# EAGLE design hpdNode (EAGLE 6.6.0)
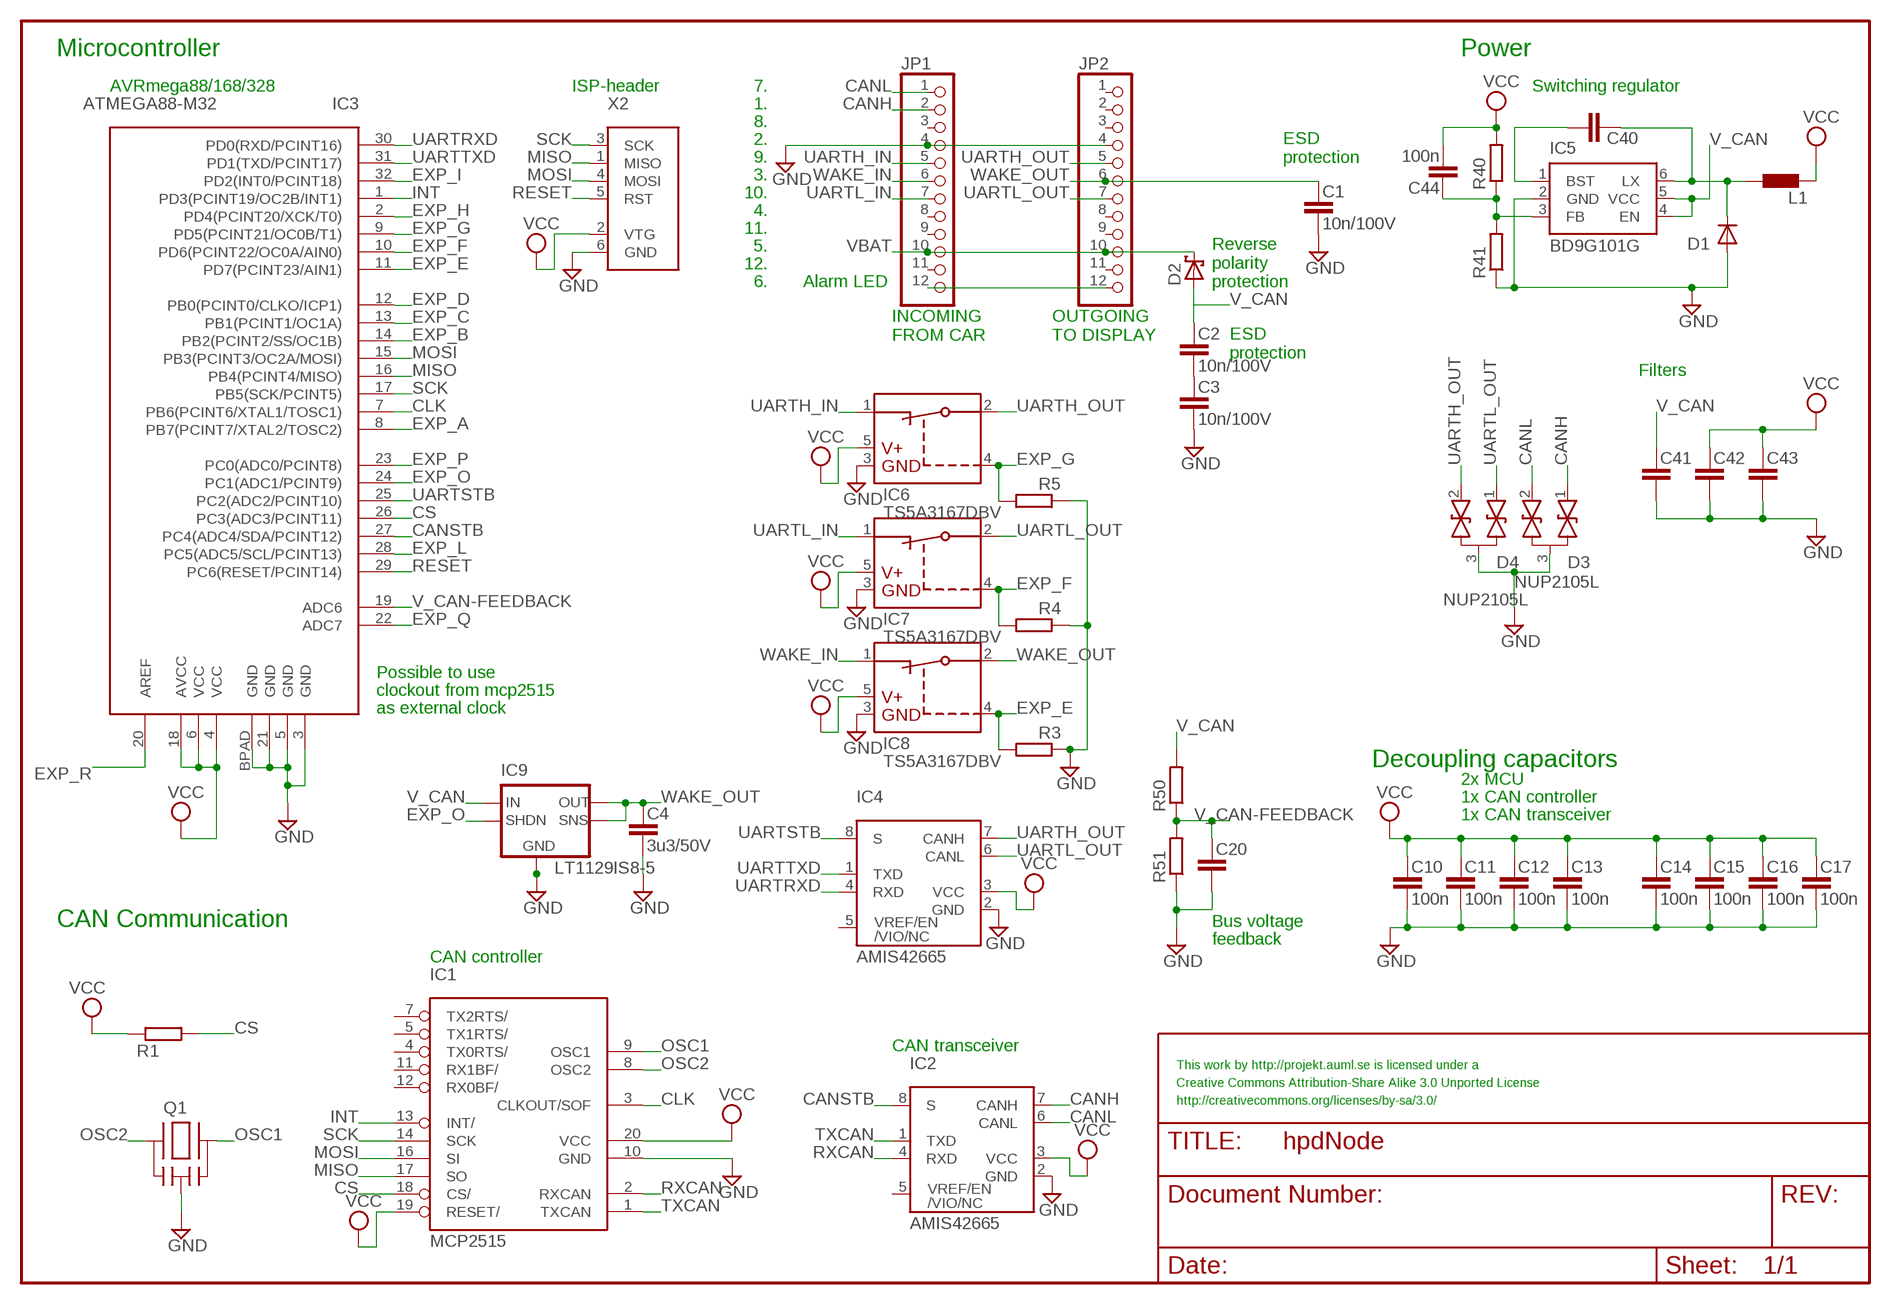
[diagram p0: schematic, sheet 1]

## Parts
C1  10n/100V  C-EUC0805  [C0805]
C2  10n/100V  C-EUC0805  [C0805]
C3  10n/100V  C-EUC0805  [C0805]
C4  3u3/50V  C-EUC1210  [C1210]
C10  100n  C-EUC0402  [C0402]
C11  100n  C-EUC0402  [C0402]
C12  100n  C-EUC0402  [C0402]
C13  100n  C-EUC0402  [C0402]
C14  100n  C-EUC0402  [C0402]
C15  100n  C-EUC0402  [C0402]
C16  100n  C-EUC0402  [C0402]
C17  100n  C-EUC0402  [C0402]
C20  C-EUC0402  [C0402]
C40  C-EUC0603  [C0603]
C41  C-EUC1210  [C1210]
C42  C-EUC0805  [C0805]
C43  C-EUC0402  [C0402]
C44  100n  C-EUC0402  [C0402]
D1  DIODESMP  [DO-220AA]
D2  SCHOTTKY-DIODESMA  [SMA]
D3  NUP2105L  DUALTVSSOT23  [SOT23]
D4  NUP2105L  DUALTVSSOT23  [SOT23]
IC1  MCP2515  [TSSOP]
IC2  AMIS42665  [SOIC]
IC3  ATMEGA88-M32  [MLF32]
IC4  AMIS42665  [SOIC]
IC5  BD9G101G  [SSOP6]
IC6  TS5A3167DBV  [SOT23-5]
IC7  TS5A3167DBV  [SOT23-5]
IC8  TS5A3167DBV  [SOT23-5]
IC9  LT1129IS8-5  LT1129-5SO8  [SO8]
JP1  PINHD-2X06  [2X06]
JP2  PINHD-2X06  [2X06]
L1  L-EUL1210  [L1210]
Q1  CSTCESMD  [SMD]
R1  R-EUR0402  [R0402]
R3  R-EUR0402  [R0402]
R4  R-EUR0402  [R0402]
R5  R-EUR0402  [R0402]
R40  R-EUR0402  [R0402]
R41  R-EUR0402  [R0402]
R50  R-EUR0402  [R0402]
R51  R-EUR0402  [R0402]
X2  AVRISP6PINHEADER  [6PINHEADER]

## Nets
CANH: D3.1 IC2.7(CANH) JP1.2
CANL: D3.2 IC2.6(CANL) JP1.1
CANSTB: IC2.8(S) IC3.27(PC4(ADC4/SDA/PCINT12))
CB: C40.1 IC5.1(BST)
CLK: IC1.3(CLKOUT/SOF) IC3.7(PB6(PCINT6/XTAL1/TOSC1))
CS: IC1.18(CS/) IC3.26(PC3(ADC3/PCINT11)) R1.2
EXP_A: IC3.8(PB7(PCINT7/XTAL2/TOSC2))
EXP_B: IC3.14(PB2(PCINT2/SS/OC1B))
EXP_C: IC3.13(PB1(PCINT1/OC1A))
EXP_D: IC3.12(PB0(PCINT0/CLKO/ICP1))
EXP_E: IC3.11(PD7(PCINT23/AIN1)) IC8.4(IN) R3.2
EXP_F: IC3.10(PD6(PCINT22/OC0A/AIN0)) IC7.4(IN) R4.2
EXP_G: IC3.9(PD5(PCINT21/OC0B/T1)) IC6.4(IN) R5.2
EXP_H: IC3.2(PD4(PCINT20/XCK/T0))
EXP_I: IC3.32(PD2(INT0/PCINT18))
EXP_L: IC3.28(PC5(ADC5/SCL/PCINT13))
EXP_O: IC3.24(PC1(ADC1/PCINT9)) IC9.5(SHDN)
EXP_P: IC3.23(PC0(ADC0/PCINT8))
EXP_Q: IC3.22(ADC7)
EXP_R: IC3.20(AREF)
GND: C1.2 C3.2 C4.2 C10.2 C11.2 C12.2 C13.2 C14.2 C15.2 C16.2 C17.2 C20.2 C41.2 C42.2 C43.2 D1.A D3.3 D4.3 IC1.10(GND) IC2.2(GND) IC3.3(GND) IC3.5(GND) IC3.21(GND) IC3.BPAD(GND) IC4.2(GND) IC5.2(GND) IC6.3(GND) IC7.3(GND) IC8.3(GND) IC9.3(GND) IC9.6(GND1) IC9.7(GND2) JP1.4 JP2.4 Q1.2(GND) R3.1 R4.1 R5.1 R41.1 R51.1 X2.6(GND)
INT: IC1.13(INT/) IC3.1(PD3(PCINT19/OC2B/INT1))
MISO: IC1.17(SO) IC3.16(PB4(PCINT4/MISO)) X2.1(MISO)
MOSI: IC1.16(SI) IC3.15(PB3(PCINT3/OC2A/MOSI)) X2.4(MOSI)
N$1: C44.1 IC5.3(FB) R40.1 R41.2
N$2: C2.2 C3.1
N$13: JP1.12 JP2.12
OSC1: IC1.9(OSC1) Q1.3
OSC2: IC1.8(OSC2) Q1.1
RESET: IC3.29(PC6(RESET/PCINT14)) X2.5(RST)
RXCAN: IC1.2(RXCAN) IC2.4(RXD)
SCK: IC1.14(SCK) IC3.17(PB5(SCK/PCINT5)) X2.3(SCK)
TXCAN: IC1.1(TXCAN) IC2.1(TXD)
UARTH_IN: IC6.1(NC) JP1.5
UARTH_OUT: D4.2 IC4.7(CANH) IC6.2(COM) JP2.5
UARTL_IN: IC7.1(NC) JP1.7
UARTL_OUT: D4.1 IC4.6(CANL) IC7.2(COM) JP2.7
UARTRXD: IC3.30(PD0(RXD/PCINT16)) IC4.4(RXD)
UARTSTB: IC3.25(PC2(ADC2/PCINT10)) IC4.8(S)
UARTTXD: IC3.31(PD1(TXD/PCINT17)) IC4.1(TXD)
V_CAN: C2.1 C41.1 D2.A IC5.4(EN) IC5.5(VCC) IC9.8(IN) R50.2
V_CAN-FEEDBACK: C20.1 IC3.19(ADC6) R50.1 R51.2
VBAT: D2.C JP1.10 JP2.10
VCC: C10.1 C11.1 C12.1 C13.1 C14.1 C15.1 C16.1 C17.1 C42.1 C43.1 C44.2 IC1.19(RESET/) IC1.20(VCC) IC2.3(VCC) IC3.4(VCC) IC3.6(VCC) IC3.18(AVCC) IC4.3(VCC) IC6.5(VCC) IC7.5(VCC) IC8.5(VCC) L1.1 R1.1 R40.2 X2.2(VTG)
VSW: C40.2 D1.C IC5.6(LX) L1.2
WAKE_IN: IC8.1(NC) JP1.6
WAKE_OUT: C1.1 C4.1 IC8.2(COM) IC9.1(OUT) IC9.2(SENSE) JP2.6
Unconnected: IC1.4(TX0RTS/) IC1.5(TX1RTS/) IC1.7(TX2RTS/) IC1.11(RX1BF/) IC1.12(RX0BF/) IC2.5(VREF/EN/VIO/NC) IC4.5(VREF/EN/VIO/NC) JP1.3 JP1.8 JP1.9 JP1.11 JP2.1 JP2.2 JP2.3 JP2.8 JP2.9 JP2.11

## Notes on the sheet
- Microcontroller | Power
- AVRmega88/168/328 | ISP-header | 7. | Switching regulator
- 1.
- 8.
- 2.
- 9.
- ESD
  protection
- 3.
- 10.
- 4.
- 11.
- 5.
- 12.
- 6. | Alarm LED
- Reverse
  polarity
  protection
- INCOMING
  FROM CAR
- OUTGOING
  TO DISPLAY
- ESD
  protection
- Filters
- Possible to use
- clockout from mcp2515
- as external clock
- Decoupling capacitors
- 2x MCU
- 1x CAN controller
- 1x CAN transceiver
- CAN Communication | Bus voltage
- feedback
- CAN controller
- CAN transceiver
- This work by http://projekt.auml.se is licensed under a
- Creative Commons Attribution-Share Alike 3.0 Unported License
- http://creativecommons.org/licenses/by-sa/3.0/

## Library data of the parts
C1-C4 C10-C17 C20 C40-C44 = rcl:C-EU
D1 = diode:DIODE: DIODE ultra fast rectifier, 3 A
D2 = diode:SCHOTTKY-DIODE
D3 D4 = diode:DUALTVS
IC1 = mcp2515:MCP2515
IC2 IC4 = amis42665:AMIS42665
IC3 = atmega88:ATMEGA88-M32
IC5 = BD9G101G:BD9G101G
IC6-IC8 = ts5a3167:TS5A3167
IC9 = lt1129:LT1129-5
JP1 JP2 = pinhead-mm:PINHD-2X06
L1 = rcl:L-EU
Q1 = xtal_CSTCE:CSTCE
R1 R3-R5 R40 R41 R50 R51 = rcl:R-EU
X2 = avrisp:AVRISP6PIN

## Board
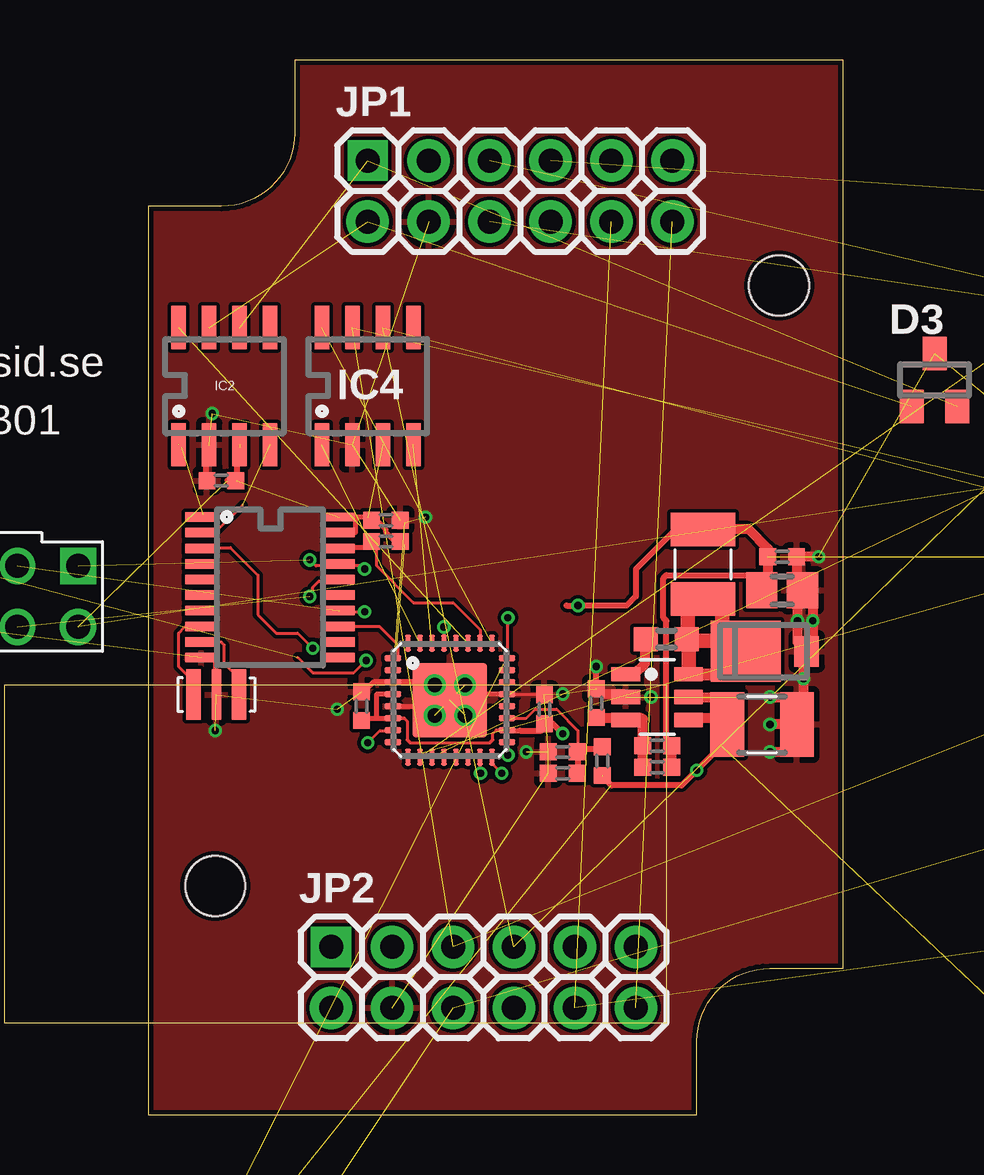
[diagram p1: board, top side]
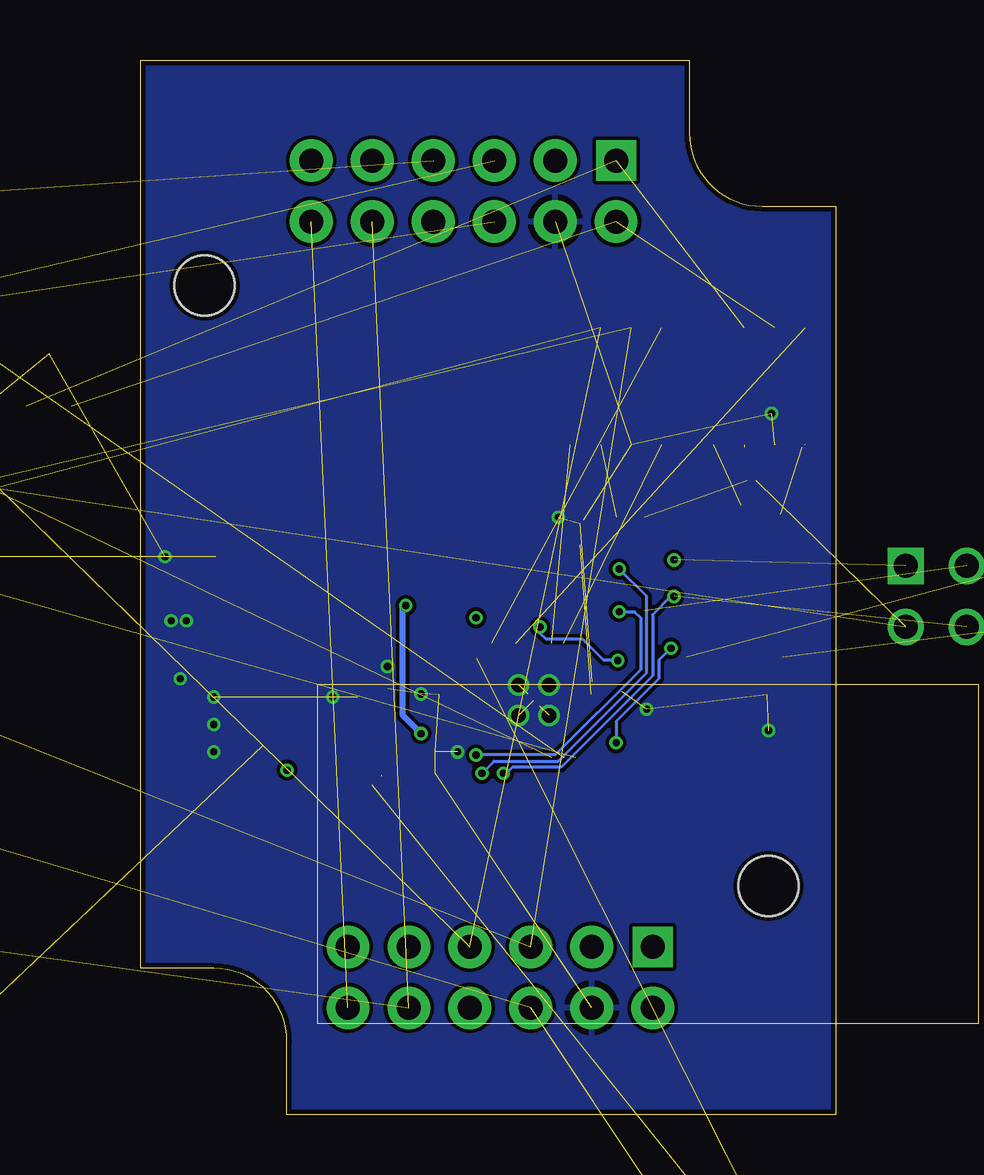
[diagram p2: board, bottom side, seen from below]

Size 28.96 x 43.94 mm. Coordinates in mm from the lower left corner, seen from the top.
Outline: 28.96,6.1 28.96,43.94 6.1,43.94 6.1,40.89 arc-90 3.05,37.85 0,37.85 0,0 22.86,0 22.86,3.05 arc-90 25.91,6.1 28.96,6.1
Copper layers (1*16): Top 0.035mm / dielectric 1.5mm / Bottom 0.035mm
Design rules "10mils, 0.6drill *": minimum track width 5mil, minimum drill 0.3mm, track to track 5mil, track to pad 5mil, pad to pad 6mil, via to via 6mil, smd to smd 0mil, copper to edge 8mil, drill to drill 10mil, minimum pad ring 10mil, minimum via ring 5mil, stop-mask expansion 0mil, vias tented up to drill 0.7mm, thermal gap 10mil
Holes 2.5 mm at 2.79,9.53 26.29,34.54
tKeepout: area 1,7.7 to 4.6,11.3; area 24.5,32.8 to 28.1,36.3
bKeepout: area 1,7.7 to 4.6,11.3; area 24.5,32.8 to 28.1,36.3
Milling: 4 lines

### Footprints (pad centres in the part's own frame; a part is rotated, then mirrored left to right if it is on the bottom)
C0805 = smd 1.3 x 1.5: 1 -0.85,0; 2 0.85,0
C1210 = smd 1.4 x 2.7: 1 -1.4,0; 2 1.5,0
C0402 = smd 0.7 x 0.7: 1 -0.6,0; 2 0.6,0
C0603 = smd 1 x 1: 1 -0.85,0; 2 0.85,0
DO-220AA = smd 1.016 x 1.27: A 1.143,0 | smd 2.921 x 2.54: C -1.397,0
SMA = smd 2.1 x 1.8: A 2.1,0; C -2.3,0
SOT23 = smd 1 x 1.4: 1 -0.95,-1.1; 2 0.95,-1.1; 3 0,1.1
TSSOP = smd 0.396 x 1.3: 1 -2.925,-2.875; 2 -2.275,-2.875; 3 -1.625,-2.875; 4 -0.975,-2.875; 5 -0.325,-2.875; 6 0.325,-2.875; 7 0.975,-2.875; 8 1.625,-2.875; 9 2.275,-2.875; 10 2.925,-2.875; 11 2.925,2.875; 12 2.275,2.875; 13 1.625,2.875; 14 0.975,2.875; 15 0.325,2.875; 16 -0.325,2.875; 17 -0.975,2.875; 18 -1.625,2.875; 19 -2.275,2.875 | smd 0.369 x 1.3: 20 -2.925,2.875
SOIC = smd 0.6 x 1.8: 1 -1.905,-2.44; 2 -0.635,-2.44; 3 0.635,-2.44; 4 1.905,-2.44; 5 1.905,2.44; 6 0.635,2.44; 7 -0.635,2.44; 8 -1.905,2.44
MLF32 = smd 0.7 x 0.24: 1 -2.375,1.75; 2 -2.375,1.25; 3 -2.375,0.75; 4 -2.375,0.25; 5 -2.375,-0.25; 6 -2.375,-0.75; 7 -2.375,-1.25; 8 -2.375,-1.75; 17 2.375,-1.75; 18 2.375,-1.25; 19 2.375,-0.75; 20 2.375,-0.25; 21 2.375,0.25; 22 2.375,0.75; 23 2.375,1.25; 24 2.375,1.75 | smd 0.24 x 0.7: 9 -1.75,-2.375; 10 -1.25,-2.375; 11 -0.75,-2.375; 12 -0.25,-2.375; 13 0.25,-2.375; 14 0.75,-2.375; 15 1.25,-2.375; 16 1.75,-2.375; 25 1.75,2.375; 26 1.25,2.375; 27 0.75,2.375; 28 0.25,2.375; 29 -0.25,2.375; 30 -0.75,2.375; 31 -1.25,2.375; 32 -1.75,2.375 | smd 3.1 x 3.1: BPAD 0,0
SSOP6 = smd 0.6 x 1.2: 1 -0.95,-1.306; 2 0,-1.306; 3 0.95,-1.306; 4 0.95,1.306; 5 0,1.306; 6 -0.95,1.306
SOT23-5 = smd 0.6 x 1.2: 1 -1.85,-0.106; 2 -0.9,-0.106; 3 0.05,-0.106; 4 0.05,2.506; 5 -1.85,2.506
SO8 = smd 0.6 x 1.8: 1 -1.905,-2.44; 2 -0.635,-2.44; 3 0.635,-2.44; 4 1.905,-2.44; 5 1.905,2.44; 6 0.635,2.44; 7 -0.635,2.44; 8 -1.905,2.44
2X06 = drill 1 pad 1.676 square: 1 -7.62,1.27 | drill 1 pad 1.778: 2 -7.62,-1.27; 3 -5.08,1.27; 4 -5.08,-1.27; 5 -2.54,1.27; 6 -2.54,-1.27; 7 0,1.27; 8 0,-1.27; 9 2.54,1.27; 10 2.54,-1.27; 11 5.08,1.27; 12 5.08,-1.27
L1210 = smd 1.4 x 2.7: 1 -1.4,0; 2 1.5,0
SMD = smd 0.6 x 2.1: 1 -0.27,0.1; 3 1.63,0.1 | smd 0.4 x 2.1: 2 0.68,0.1
R0402 = smd 0.7 x 0.7: 1 -0.6,0; 2 0.6,0
6PINHEADER = drill 1 square: 1 -1.27,2.54 | drill 1: 2 1.27,2.54; 3 -1.27,0; 4 1.27,0; 5 -1.27,-2.54; 6 1.27,-2.54

### Placement (x,y rotation side)
C1  54.36,16.64 0 top  (outside the outline)
C2  39.24,1.65 0 top  (outside the outline)
C3  43.69,1.4 0 top  (outside the outline)
C4  -10.16,-31.62 0 top  (outside the outline)
C10  3.05,26.42 180 top
C11  16.51,16.89 90 top
C12  9.91,24.77 0 top
C13  8.89,17.02 90 top
C14  42.16,16.89 0 top  (outside the outline)
C15  41.15,23.24 0 top  (outside the outline)
C16  46.61,12.7 0 top  (outside the outline)
C17  51.44,11.05 0 top  (outside the outline)
C20  17.27,15.11 180 top
C40  21.59,19.81 0 top
C41  25.53,16.26 0 top
C42  26.42,21.84 0 top
C43  26.42,23.24 0 top
C44  21.21,14.48 0 top
D1  26.29,19.3 0 top
D2  43.94,7.75 0 top  (outside the outline)
D3  32.77,30.61 0 top
D4  37.46,26.8 0 top  (outside the outline)
IC1  5.08,21.97 270 top
IC2  3.18,30.35 0 top
IC3  12.57,17.27 0 top
IC4  9.14,30.35 0 top
IC5  21.21,17.4 270 top
IC6  66.17,28.07 0 top  (outside the outline)
IC7  47.75,37.85 0 top  (outside the outline)
IC8  52.45,31.88 0 top  (outside the outline)
IC9  -7.75,-24.76 0 top  (outside the outline)
JP1  16.76,38.48 0 top
JP2  15.24,5.72 0 top
L1  23.11,22.99 270 top
Q1  2.16,17.4 0 top
R1  9.91,23.88 180 top
R3  56.26,36.07 0 top  (outside the outline)
R4  51.94,40.51 0 top  (outside the outline)
R5  68.45,30.99 0 top  (outside the outline)
R40  21.21,15.37 0 top
R41  18.67,17.15 270 top
R50  18.92,14.73 270 top
R51  17.27,14.22 0 top
X2  -5.46,21.59 270 top

### Tracks (layer width: path | path; a pad name or v marks a point on that pad's centre or on a via)
CANH  (2 unrouted)
CANL  (2 unrouted)
CANSTB  (1 unrouted)
CB
  Top 0.152: C40.1 20.7,19.81 20.57,19.69
  Top 0.406: IC5.1 20.25,18.35 20.7,18.8 20.7,19.77
  Top 0.61: C40.1 20.7,19.77
CLK  (via drill 0.3)
  Top 0.127: IC3.7 10.18,16.02 10.16,16 9.65,16 v9.14,15.49 | v6.86,19.43 6.22,20.07 5.33,20.07 4.57,20.83 4.57,22.48 3.43,23.62 2.29,23.62 2.26,23.6 IC1.3
  Bottom 0.127: v9.14,15.49 9.14,16.38 7.37,18.16 7.37,18.92 v6.86,19.43
CS
  Top 0.127: IC3.26 13.82,19.58 13.84,19.56 13.84,20.19 12.7,21.34 11.05,21.34 9.53,22.86 9.53,23.62 9.4,23.75 9.4,23.62
  Top 0.203: IC1.18 7.98,23.6 8,23.62 9.4,23.62 R1.2
EXP_D
  Top 0.127: IC3.12 12.32,14.86 12.32,14.61
EXP_E  (2 unrouted)
EXP_F  (2 unrouted)
EXP_G  (2 unrouted)
EXP_O  (via drill 0.3)  (1 unrouted)
  Top 0.127: IC3.24 14.99,19.05 v14.99,20.7
  Bottom 0.127: v14.99,20.7 14.86,20.83
GND  (via drill 0.3, 0.6)  (60 unrouted)
  Top 0.127: IC3.21 16.38,17.52
  Top 0.203: C13.2 9.02,17.65 9.4,18.03 10.16,18.03 10.17,18.02 IC3.3 10.28,18.02 10.29,18.03 11.81,18.03 v11.94,17.91 IC3.BPAD | IC3.5 10.28,17.02 10.29,17.02 12.32,17.02 IC3.BPAD | IC3.21 14.86,17.52 14.86,17.53 12.83,17.53 IC3.BPAD | C11.2 16.51,17.53 16.38,17.52 | Q1.2 2.79,17.54 2.79,19.05 IC1.10
  Top 0.254: 2.51,27.91 2.41,27.81 2.41,26.42 C10.2 | C12.2 10.54,24.77 10.67,24.64 | R41.1 v18.67,18.67
  Top 0.406: v25.91,16.26 C41.2 27.03,15.77 27.05,15.75 | v25.91,17.4 26.92,17.4 27.05,17.27 | v25.91,15.11 26.67,15.11 arc90 27.05,15.49 27.05,15.75 | 27.05,17.27 27.3,17.27 v27.3,18.16 27.3,19.18 D1.A | v27.69,20.57 27.69,19.56 D1.A | D1.A 27.05,19.69 v27.05,20.57 27.05,21.46 27.27,21.68 C42.2 | C42.2 27.56,21.84 27.69,21.72 27.69,20.7 | v27.94,23.24 C43.2 27.02,22.09 C42.2 | 27.05,15.75 27.05,17.27 | R41.1 18.7,17.75 18.92,17.53 19.78,17.53 IC5.2
  other vias: 2.67,29.21 13.21,17.91 11.94,16.64 13.21,16.64 -9.52,7.75 -7.98,7.85 -6.98,7.62 -7.87,5.72 17.27,17.53 20.95,17.4 -10.79,5.72 -10.41,3.81 -7.62,3.94 -7.37,4.57 -9.52,4.83 -8.51,3.81 -8.51,4.57 -10.54,8 -9.02,8.64 -10.41,6.86 11.56,24.89 2.79,16 7.87,16.89 -7.85,6.71 -8.61,5.82 -8.61,6.96 -9.75,6.2 -7.09,5.56 -7.11,6.86 15.75,15.11
  pour Bottom (isolate 0.152, rank 3): 28.96,43.94 28.96,6.1 25.91,6.1 arc90 22.86,3.05 22.86,0 0,0 0,37.85 3.05,37.85 arc90 6.1,40.89 6.1,43.94
  pour Top (isolate 0.152, rank 3): 28.96,43.94 28.96,6.1 25.91,6.1 arc90 22.86,3.05 22.86,0 0,0 0,37.85 3.05,37.85 arc90 6.1,40.89 6.1,43.94
INT
  Top 0.127: IC3.1 10.16,19.05 10.41,19.05 10.41,19.56 9.65,20.32 8,20.32 7.97,20.35 IC1.13
MISO  (via drill 0.3)  (1 unrouted)
  Top 0.127: IC3.16 14.35,14.61 v14.73,14.22 | v6.73,23.11 6.99,22.86 7.87,22.86 7.87,22.87 IC1.17 7.95,22.91 8,22.86 8.89,22.86 v9.02,22.73
  Bottom 0.127: v14.73,14.22 14.22,14.73 11.56,14.73 7.87,18.41 7.87,21.59 v9.02,22.73
MOSI  (via drill 0.3)  (1 unrouted)
  Top 0.127: IC3.15 13.84,14.88 v13.84,14.22 | v6.73,21.59 6.86,21.72 6.86,21.97 7.11,22.23 8,22.23 IC1.16
  Bottom 0.127: v13.84,14.22 13.72,14.22 13.46,14.48 11.43,14.48 7.62,18.29 7.62,20.83 6.86,21.59 v6.73,21.59
N$1
  Top 0.254: 19.81,16.55 IC5.3 19.96,16.51
  Top 0.406: 19.96,16.51 20.57,16.51 20.61,16.48 R40.1 C44.1 | R41.2 19.81,16.55
N$2  (1 unrouted)
N$13  (1 unrouted)
OSC1
  Top 0.127: 2.29,19.69 2.27,19.7 IC1.9 2.22,19.69 2.29,19.69 | 2.29,19.69 3.05,19.69 3.18,19.56 3.18,18.8 3.79,18.19 Q1.3
OSC2
  Top 0.127: IC1.8 2.16,20.32 1.52,20.32 1.27,20.07 1.27,18.67 1.78,18.16 1.78,17.53 1.81,17.5 Q1.1
RESET  (via drill 0.3)  (1 unrouted)
  Top 0.127: v12.32,20.32 12.32,19.69 12.32,19.68 IC3.29 | v9.08,18.92 8.57,18.41 6.86,18.41 6.22,19.05
  Bottom 0.127: v12.32,20.32 12.32,20.07 12.06,19.81 10.54,19.81 9.65,18.92 v9.08,18.92
RXCAN  (1 unrouted)
  Top 0.127: IC1.2 2.28,24.25 2.41,24.38 2.92,24.38 3.94,25.4
SCK  (via drill 0.3)  (1 unrouted)
  Top 0.127: IC3.17 15.1,15.49 14.99,15.49 v14.99,14.99 | IC1.14 8,20.95 v9.02,20.95
  Bottom 0.127: v14.99,14.99 11.68,14.99 8.13,18.54 8.13,20.7 8.38,20.95 v9.02,20.95
TXCAN  (2 unrouted)
  Top 0.127: IC1.1 2.2,24.94 2.29,25.02 | 1.4,27.81 1.27,27.94
UARTH_IN  (1 unrouted)
UARTH_OUT  (3 unrouted)
UARTL_IN  (1 unrouted)
UARTL_OUT  (3 unrouted)
UARTRXD  (1 unrouted)
UARTSTB  (1 unrouted)
UARTTXD  (1 unrouted)
V_CAN  (via drill 0.3)  (4 unrouted)
  Top 0.254: 18.92,14.1 19.3,13.72 22.23,13.72 v22.86,14.35 23.88,15.37 23.75,15.5 C41.1 | IC5.4 22.61,16.36
  Top 0.406: IC5.4 22.58,16.51 23.75,16.51 24,16.26 C41.1 23.88,16.51 23.88,17.27 23.75,17.4 IC5.5
V_CAN-FEEDBACK
  Top 0.127: 14.99,16.51 15.75,16.51 16.13,16.89 17.02,16.89 17.91,16 17.91,15.37 C20.1
  Top 0.203: IC3.19 14.97,16.52 14.99,16.51 | C20.1 17.87,15.15
  Top 0.254: R50.1 18.89,15.33 18.8,15.24 17.91,15.24 | R51.2 18,14.19 17.91,14.22 17.91,15.24 | C20.1 17.91,15.24
VBAT  (2 unrouted)
VCC  (via drill 0.3)  (12 unrouted)
  Top 0.127: IC3.4 10.16,17.52 10.16,17.53 | 10.67,16.51 10.79,16.38 10.79,15.62 | 10.92,15.49 14.22,15.49 | 14.35,15.62 14.35,15.88 14.5,16.02 | 8.64,24.26 7.96,24.26 IC1.19
  Top 0.152: IC3.6 10.28,16.52 10.29,16.51 10.67,16.51 | 10.79,15.62 10.92,15.49 | 14.22,15.49 14.35,15.62 | 14.5,16.02 IC3.18
  Top 0.203: IC3.18 14.97,16.02 14.99,16 15.49,16 | 8.64,24.89 9.14,24.89 9.27,24.77 C12.1 9.53,24.77 9.91,24.38 9.91,24.26 10.29,23.88 10.54,23.88 10.67,23.75 | IC1.20 7.99,24.9 8.64,24.89 | IC1.19 7.99,24.25 8.64,24.26 8.64,24.89 | IC3.6 10.17,16.52 10.16,16.51 9.53,16.51 | 9.53,16.51 9.14,16.51 9.05,16.42 C13.1 8.8,16.42 | 10.16,17.53 9.53,17.53 9.53,16.51
  Top 0.254: C11.1 16.51,16.38 | C11.1 16.42,16.29 16.38,16 15.49,16 | 3.81,27.81 3.68,27.69 3.68,26.42 C10.1 3.3,26.42 | 10.67,23.75 R1.1 | L1.1 21.97,24.39 20.32,22.73 20.32,21.59 19.94,21.21 v17.91,21.21 17.43,21.21 | R40.2 21.59,15.27 21.59,20.57 21.46,20.7 21.46,22.35 21.59,22.48 25.69,22.48 25.82,22.35 | v17.27,15.88 16.86,16.29 C11.1
  Top 0.406: C42.1 25.82,22.09 25.82,22.35 C43.1 25.82,23.59 25.02,24.38 L1.1 | C44.2 R40.2
  Bottom 0.254: v17.91,21.21 18.03,21.08 18.03,16.64 v17.27,15.88
VSW
  Top 0.305: 24.64,19.58 D1.C
  Top 0.406: 24.89,18.35 D1.C | 22.52,19.75 22.52,19.81 C40.2 22.48,19.81 | 22.48,21.21 23.11,21.21 L1.2 23.2,21.4 23.91,21.4
  Top 0.508: IC5.6 24.89,18.35
  Top 0.61: IC5.6 22.52,19.75 24.89,19.75 | 22.48,19.81 22.48,21.21 | 23.91,21.4 23.91,20
WAKE_IN  (1 unrouted)
WAKE_OUT  (5 unrouted)

### Text on the board
Top: Copper, top side
Bottom: Copper, bottom side
tPlace: www.esid.se | EB01 | Silcscreen, top side
tStop: Soldermask, top side
bStop: Soldermask, bottom side
Milling: Cut border
Document: This work by http://projekt.auml.se is licensed under a | Creative Commons Attribution-Share Alike 3.0 Unported License | http://creativecommons.org/licenses/by-sa/3.0/
Reference: Component layout